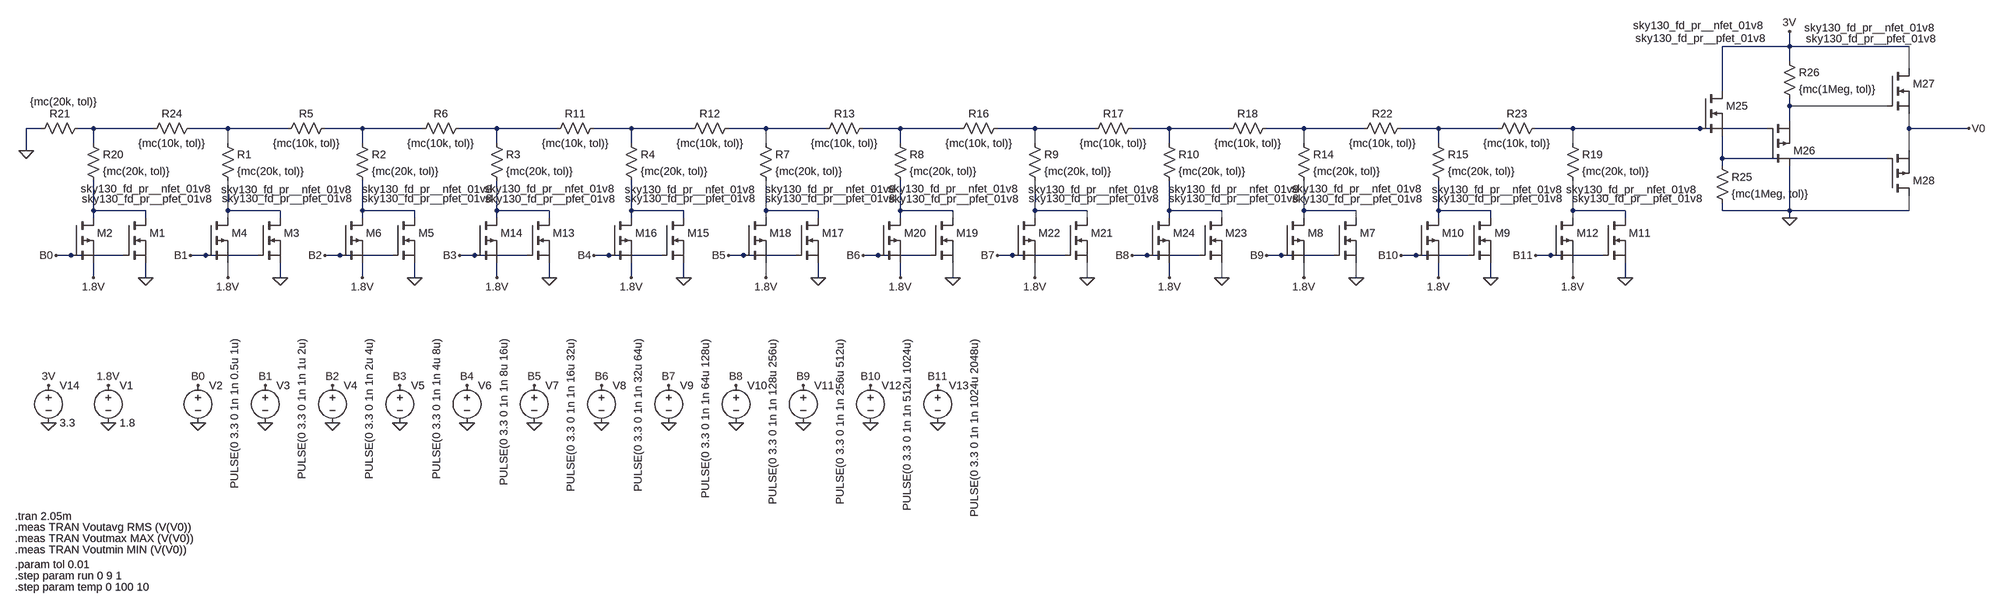
[diagram p0: schematic R2R.asc]
R2R.asc, the LTspice schematic file:
Version 4
SHEET 1 4584 1200
WIRE 3712 -96 3712 -128
WIRE 3712 -96 3568 -96
WIRE 3968 -96 3712 -96
WIRE 3712 -64 3712 -96
WIRE 3968 -48 3968 -96
WIRE 3568 0 3568 -96
WIRE 3712 32 3712 16
WIRE 3920 32 3712 32
WIRE 3712 64 3712 32
WIRE -32 80 -64 80
WIRE 80 80 48 80
WIRE 208 80 80 80
WIRE 368 80 288 80
WIRE 496 80 368 80
WIRE 656 80 576 80
WIRE 784 80 656 80
WIRE 944 80 864 80
WIRE 1072 80 944 80
WIRE 1232 80 1152 80
WIRE 1360 80 1232 80
WIRE 1520 80 1440 80
WIRE 1648 80 1520 80
WIRE 1808 80 1728 80
WIRE 1936 80 1808 80
WIRE 2096 80 2016 80
WIRE 2224 80 2096 80
WIRE 2384 80 2304 80
WIRE 2512 80 2384 80
WIRE 2672 80 2592 80
WIRE 2800 80 2672 80
WIRE 2960 80 2880 80
WIRE 3088 80 2960 80
WIRE 3248 80 3168 80
WIRE 3520 80 3248 80
WIRE 3664 80 3520 80
WIRE 3968 80 3968 48
WIRE 4096 80 3968 80
WIRE 80 112 80 80
WIRE 368 112 368 80
WIRE 656 112 656 80
WIRE 944 112 944 80
WIRE 1232 112 1232 80
WIRE 1520 112 1520 80
WIRE 1808 112 1808 80
WIRE 2096 112 2096 80
WIRE 2384 112 2384 80
WIRE 2672 112 2672 80
WIRE 2960 112 2960 80
WIRE 3248 112 3248 80
WIRE -64 128 -64 80
WIRE 3968 128 3968 80
WIRE 3568 144 3568 96
WIRE 3920 144 3568 144
WIRE 3568 160 3568 144
WIRE 80 256 80 192
WIRE 192 256 80 256
WIRE 368 256 368 192
WIRE 480 256 368 256
WIRE 656 256 656 192
WIRE 768 256 656 256
WIRE 944 256 944 192
WIRE 1056 256 944 256
WIRE 1232 256 1232 192
WIRE 1344 256 1232 256
WIRE 1520 256 1520 192
WIRE 1632 256 1520 256
WIRE 1808 256 1808 192
WIRE 1920 256 1808 256
WIRE 2096 256 2096 192
WIRE 2208 256 2096 256
WIRE 2384 256 2384 192
WIRE 2496 256 2384 256
WIRE 2672 256 2672 192
WIRE 2784 256 2672 256
WIRE 2960 256 2960 192
WIRE 3072 256 2960 256
WIRE 3248 256 3248 192
WIRE 3360 256 3248 256
WIRE 3568 256 3568 240
WIRE 3712 256 3712 160
WIRE 3712 256 3568 256
WIRE 3968 256 3968 224
WIRE 3968 256 3712 256
WIRE 80 272 80 256
WIRE 192 272 192 256
WIRE 368 272 368 256
WIRE 480 272 480 256
WIRE 656 272 656 256
WIRE 768 272 768 256
WIRE 944 272 944 256
WIRE 1056 272 1056 256
WIRE 1232 272 1232 256
WIRE 1344 272 1344 256
WIRE 1520 272 1520 256
WIRE 1632 272 1632 256
WIRE 1808 272 1808 256
WIRE 1920 272 1920 256
WIRE 2096 272 2096 256
WIRE 2208 272 2208 256
WIRE 2384 272 2384 256
WIRE 2496 272 2496 256
WIRE 2672 272 2672 256
WIRE 2784 272 2784 256
WIRE 2960 272 2960 256
WIRE 3072 272 3072 256
WIRE 3248 272 3248 256
WIRE 3360 272 3360 256
WIRE 3712 272 3712 256
WIRE 32 352 0 352
WIRE 144 352 32 352
WIRE 320 352 288 352
WIRE 432 352 320 352
WIRE 608 352 576 352
WIRE 720 352 608 352
WIRE 896 352 864 352
WIRE 1008 352 896 352
WIRE 1184 352 1152 352
WIRE 1296 352 1184 352
WIRE 1472 352 1440 352
WIRE 1584 352 1472 352
WIRE 1760 352 1728 352
WIRE 1872 352 1760 352
WIRE 2048 352 2016 352
WIRE 2160 352 2048 352
WIRE 2336 352 2304 352
WIRE 2448 352 2336 352
WIRE 2624 352 2592 352
WIRE 2736 352 2624 352
WIRE 2912 352 2880 352
WIRE 3024 352 2912 352
WIRE 3200 352 3168 352
WIRE 3312 352 3200 352
WIRE 80 400 80 368
WIRE 192 400 192 368
WIRE 368 400 368 368
WIRE 480 400 480 368
WIRE 656 400 656 368
WIRE 768 400 768 368
WIRE 944 400 944 368
WIRE 1056 400 1056 368
WIRE 1232 400 1232 368
WIRE 1344 400 1344 368
WIRE 1520 400 1520 368
WIRE 1632 400 1632 368
WIRE 1808 400 1808 368
WIRE 1920 400 1920 368
WIRE 2096 400 2096 368
WIRE 2208 400 2208 368
WIRE 2384 400 2384 368
WIRE 2496 400 2496 368
WIRE 2672 400 2672 368
WIRE 2784 400 2784 368
WIRE 2960 400 2960 368
WIRE 3072 400 3072 368
WIRE 3248 400 3248 368
WIRE 3360 400 3360 368
FLAG -64 128 0
FLAG 0 352 B0
FLAG 192 400 0
FLAG 80 400 1.8V
FLAG 288 352 B1
FLAG 480 400 0
FLAG 576 352 B2
FLAG 768 400 0
FLAG 2592 352 B9
FLAG 2784 400 0
FLAG 2880 352 B10
FLAG 3072 400 0
FLAG 3168 352 B11
FLAG 3360 400 0
FLAG 864 352 B3
FLAG 1056 400 0
FLAG 1152 352 B4
FLAG 1344 400 0
FLAG 1440 352 B5
FLAG 1632 400 0
FLAG 1728 352 B6
FLAG 1920 400 0
FLAG 2016 352 B7
FLAG 2208 400 0
FLAG 2304 352 B8
FLAG 2496 400 0
FLAG 112 704 1.8V
FLAG 112 784 0
FLAG 304 704 B0
FLAG 304 784 0
FLAG 448 704 B1
FLAG 448 784 0
FLAG 592 704 B2
FLAG 592 784 0
FLAG 736 704 B3
FLAG 736 784 0
FLAG 880 704 B4
FLAG 880 784 0
FLAG 1024 704 B5
FLAG 1024 784 0
FLAG 1168 704 B6
FLAG 1168 784 0
FLAG 1312 704 B7
FLAG 1312 784 0
FLAG 1456 704 B8
FLAG 1456 784 0
FLAG 1600 704 B9
FLAG 1600 784 0
FLAG 1744 704 B10
FLAG 1744 784 0
FLAG 1888 704 B11
FLAG 1888 784 0
FLAG 3712 272 0
FLAG 3712 -128 3V
FLAG 4096 80 V0
FLAG -16 704 3V
FLAG -16 784 0
FLAG 368 400 1.8V
FLAG 656 400 1.8V
FLAG 944 400 1.8V
FLAG 1232 400 1.8V
FLAG 1520 400 1.8V
FLAG 1808 400 1.8V
FLAG 2096 400 1.8V
FLAG 2384 400 1.8V
FLAG 2672 400 1.8V
FLAG 2960 400 1.8V
FLAG 3248 400 1.8V
SYMBOL nmos 144 272 R0
WINDOW 3 -91 -63 Left 2
SYMATTR Value sky130_fd_pr__nfet_01v8
SYMATTR InstName M1
SYMBOL pmos 32 272 R0
WINDOW 3 23 -41 Left 2
SYMATTR Value sky130_fd_pr__pfet_01v8
SYMATTR InstName M2
SYMBOL nmos 432 272 R0
WINDOW 3 -78 -61 Left 2
SYMATTR Value sky130_fd_pr__nfet_01v8
SYMATTR InstName M3
SYMBOL pmos 320 272 R0
WINDOW 3 35 -42 Left 2
SYMATTR Value sky130_fd_pr__pfet_01v8
SYMATTR InstName M4
SYMBOL nmos 720 272 R0
WINDOW 3 -65 -62 Left 2
SYMATTR Value sky130_fd_pr__nfet_01v8
SYMATTR InstName M5
SYMBOL pmos 608 272 R0
WINDOW 3 47 -42 Left 2
SYMATTR Value sky130_fd_pr__pfet_01v8
SYMATTR InstName M6
SYMBOL nmos 2736 272 R0
WINDOW 3 -91 -63 Left 2
SYMATTR Value sky130_fd_pr__nfet_01v8
SYMATTR InstName M7
SYMBOL pmos 2624 272 R0
WINDOW 3 23 -41 Left 2
SYMATTR Value sky130_fd_pr__pfet_01v8
SYMATTR InstName M8
SYMBOL nmos 3024 272 R0
WINDOW 3 -78 -61 Left 2
SYMATTR Value sky130_fd_pr__nfet_01v8
SYMATTR InstName M9
SYMBOL pmos 2912 272 R0
WINDOW 3 35 -42 Left 2
SYMATTR Value sky130_fd_pr__pfet_01v8
SYMATTR InstName M10
SYMBOL pmos 3200 272 R0
WINDOW 3 47 -42 Left 2
SYMATTR Value sky130_fd_pr__pfet_01v8
SYMATTR InstName M12
SYMBOL nmos 1008 272 R0
WINDOW 3 -91 -63 Left 2
SYMATTR Value sky130_fd_pr__nfet_01v8
SYMATTR InstName M13
SYMBOL pmos 896 272 R0
WINDOW 3 23 -41 Left 2
SYMATTR Value sky130_fd_pr__pfet_01v8
SYMATTR InstName M14
SYMBOL nmos 1296 272 R0
WINDOW 3 -78 -61 Left 2
SYMATTR Value sky130_fd_pr__nfet_01v8
SYMATTR InstName M15
SYMBOL pmos 1184 272 R0
WINDOW 3 35 -42 Left 2
SYMATTR Value sky130_fd_pr__pfet_01v8
SYMATTR InstName M16
SYMBOL nmos 1584 272 R0
WINDOW 3 -65 -62 Left 2
SYMATTR Value sky130_fd_pr__nfet_01v8
SYMATTR InstName M17
SYMBOL pmos 1472 272 R0
WINDOW 3 47 -42 Left 2
SYMATTR Value sky130_fd_pr__pfet_01v8
SYMATTR InstName M18
SYMBOL nmos 1872 272 R0
WINDOW 3 -91 -63 Left 2
SYMATTR Value sky130_fd_pr__nfet_01v8
SYMATTR InstName M19
SYMBOL pmos 1760 272 R0
WINDOW 3 23 -41 Left 2
SYMATTR Value sky130_fd_pr__pfet_01v8
SYMATTR InstName M20
SYMBOL nmos 2160 272 R0
WINDOW 3 -78 -61 Left 2
SYMATTR Value sky130_fd_pr__nfet_01v8
SYMATTR InstName M21
SYMBOL pmos 2048 272 R0
WINDOW 3 35 -42 Left 2
SYMATTR Value sky130_fd_pr__pfet_01v8
SYMATTR InstName M22
SYMBOL nmos 2448 272 R0
WINDOW 3 -65 -62 Left 2
SYMATTR Value sky130_fd_pr__nfet_01v8
SYMATTR InstName M23
SYMBOL pmos 2336 272 R0
WINDOW 3 47 -42 Left 2
SYMATTR Value sky130_fd_pr__pfet_01v8
SYMATTR InstName M24
SYMBOL voltage 112 688 R0
WINDOW 123 0 0 Left 0
WINDOW 39 0 0 Left 0
SYMATTR InstName V1
SYMATTR Value 1.8
SYMBOL voltage 304 688 R0
WINDOW 3 79 -86 VRight 2
WINDOW 123 0 0 Left 0
WINDOW 39 0 0 Left 0
SYMATTR Value PULSE(0 3.3 0 1n 1n 0.5u 1u)
SYMATTR InstName V2
SYMBOL voltage 448 688 R0
WINDOW 3 79 -86 VRight 2
WINDOW 123 0 0 Left 0
WINDOW 39 0 0 Left 0
SYMATTR Value PULSE(0 3.3 0 1n 1n 1u 2u)
SYMATTR InstName V3
SYMBOL voltage 592 688 R0
WINDOW 3 79 -86 VRight 2
WINDOW 123 0 0 Left 0
WINDOW 39 0 0 Left 0
SYMATTR Value PULSE(0 3.3 0 1n 1n 2u 4u)
SYMATTR InstName V4
SYMBOL voltage 736 688 R0
WINDOW 3 79 -86 VRight 2
WINDOW 123 0 0 Left 0
WINDOW 39 0 0 Left 0
SYMATTR Value PULSE(0 3.3 0 1n 1n 4u 8u)
SYMATTR InstName V5
SYMBOL voltage 880 688 R0
WINDOW 3 79 -86 VRight 2
WINDOW 123 0 0 Left 0
WINDOW 39 0 0 Left 0
SYMATTR Value PULSE(0 3.3 0 1n 1n 8u 16u)
SYMATTR InstName V6
SYMBOL voltage 1024 688 R0
WINDOW 3 79 -86 VRight 2
WINDOW 123 0 0 Left 0
WINDOW 39 0 0 Left 0
SYMATTR Value PULSE(0 3.3 0 1n 1n 16u 32u)
SYMATTR InstName V7
SYMBOL voltage 1168 688 R0
WINDOW 3 79 -86 VRight 2
WINDOW 123 0 0 Left 0
WINDOW 39 0 0 Left 0
SYMATTR Value PULSE(0 3.3 0 1n 1n 32u 64u)
SYMATTR InstName V8
SYMBOL voltage 1312 688 R0
WINDOW 3 79 -86 VRight 2
WINDOW 123 0 0 Left 0
WINDOW 39 0 0 Left 0
SYMATTR Value PULSE(0 3.3 0 1n 1n 64u 128u)
SYMATTR InstName V9
SYMBOL voltage 1456 688 R0
WINDOW 3 79 -86 VRight 2
WINDOW 123 0 0 Left 0
WINDOW 39 0 0 Left 0
SYMATTR Value PULSE(0 3.3 0 1n 1n 128u 256u)
SYMATTR InstName V10
SYMBOL voltage 1600 688 R0
WINDOW 3 79 -86 VRight 2
WINDOW 123 0 0 Left 0
WINDOW 39 0 0 Left 0
SYMATTR Value PULSE(0 3.3 0 1n 1n 256u 512u)
SYMATTR InstName V11
SYMBOL voltage 1744 688 R0
WINDOW 3 79 -86 VRight 2
WINDOW 123 0 0 Left 0
WINDOW 39 0 0 Left 0
SYMATTR Value PULSE(0 3.3 0 1n 1n 512u 1024u)
SYMATTR InstName V12
SYMBOL voltage 1888 688 R0
WINDOW 3 79 -86 VRight 2
WINDOW 123 0 0 Left 0
WINDOW 39 0 0 Left 0
SYMATTR Value PULSE(0 3.3 0 1n 1n 1024u 2048u)
SYMATTR InstName V13
SYMBOL nmos 3520 0 R0
WINDOW 3 224 -136 Left 2
SYMATTR Value sky130_fd_pr__nfet_01v8
SYMATTR InstName M25
SYMBOL pmos 3664 160 M180
WINDOW 3 83 272 Left 2
SYMATTR Value sky130_fd_pr__pfet_01v8
SYMATTR InstName M26
SYMBOL nmos 3920 -48 R0
WINDOW 3 -543 -93 Left 2
SYMATTR Value sky130_fd_pr__nfet_01v8
SYMATTR InstName M27
SYMBOL res 3552 144 R0
SYMATTR InstName R25
SYMATTR Value {mc(1Meg, tol)}
SYMBOL res 3696 -80 R0
SYMATTR InstName R26
SYMATTR Value {mc(1Meg, tol)}
SYMBOL pmos 3920 224 M180
WINDOW 3 -538 337 Left 2
SYMATTR Value sky130_fd_pr__pfet_01v8
SYMATTR InstName M28
SYMBOL voltage -16 688 R0
WINDOW 123 0 0 Left 0
WINDOW 39 0 0 Left 0
SYMATTR InstName V14
SYMATTR Value 3.3
SYMBOL res 304 64 R90
WINDOW 0 0 56 VBottom 2
WINDOW 3 32 56 VTop 2
SYMATTR InstName R24
SYMATTR Value {mc(10k, tol)}
SYMBOL nmos 3312 272 R0
WINDOW 3 -78 -61 Left 2
SYMATTR Value sky130_fd_pr__nfet_01v8
SYMATTR InstName M11
SYMBOL res 64 64 R90
WINDOW 0 0 56 VBottom 2
WINDOW 3 -57 48 VTop 2
SYMATTR InstName R21
SYMATTR Value {mc(20k, tol)}
SYMBOL res 64 96 R0
SYMATTR InstName R20
SYMATTR Value {mc(20k, tol)}
SYMBOL res 352 96 R0
SYMATTR InstName R1
SYMATTR Value {mc(20k, tol)}
SYMBOL res 640 96 R0
SYMATTR InstName R2
SYMATTR Value {mc(20k, tol)}
SYMBOL res 928 96 R0
SYMATTR InstName R3
SYMATTR Value {mc(20k, tol)}
SYMBOL res 1216 96 R0
SYMATTR InstName R4
SYMATTR Value {mc(20k, tol)}
SYMBOL res 1504 96 R0
SYMATTR InstName R7
SYMATTR Value {mc(20k, tol)}
SYMBOL res 1792 96 R0
SYMATTR InstName R8
SYMATTR Value {mc(20k, tol)}
SYMBOL res 2080 96 R0
SYMATTR InstName R9
SYMATTR Value {mc(20k, tol)}
SYMBOL res 2368 96 R0
SYMATTR InstName R10
SYMATTR Value {mc(20k, tol)}
SYMBOL res 2656 96 R0
SYMATTR InstName R14
SYMATTR Value {mc(20k, tol)}
SYMBOL res 2944 96 R0
SYMATTR InstName R15
SYMATTR Value {mc(20k, tol)}
SYMBOL res 3232 96 R0
SYMATTR InstName R19
SYMATTR Value {mc(20k, tol)}
SYMBOL res 592 64 R90
WINDOW 0 0 56 VBottom 2
WINDOW 3 32 56 VTop 2
SYMATTR InstName R5
SYMATTR Value {mc(10k, tol)}
SYMBOL res 880 64 R90
WINDOW 0 0 56 VBottom 2
WINDOW 3 32 56 VTop 2
SYMATTR InstName R6
SYMATTR Value {mc(10k, tol)}
SYMBOL res 1168 64 R90
WINDOW 0 0 56 VBottom 2
WINDOW 3 32 56 VTop 2
SYMATTR InstName R11
SYMATTR Value {mc(10k, tol)}
SYMBOL res 1456 64 R90
WINDOW 0 0 56 VBottom 2
WINDOW 3 32 56 VTop 2
SYMATTR InstName R12
SYMATTR Value {mc(10k, tol)}
SYMBOL res 1744 64 R90
WINDOW 0 0 56 VBottom 2
WINDOW 3 32 56 VTop 2
SYMATTR InstName R13
SYMATTR Value {mc(10k, tol)}
SYMBOL res 2032 64 R90
WINDOW 0 0 56 VBottom 2
WINDOW 3 32 56 VTop 2
SYMATTR InstName R16
SYMATTR Value {mc(10k, tol)}
SYMBOL res 2320 64 R90
WINDOW 0 0 56 VBottom 2
WINDOW 3 32 56 VTop 2
SYMATTR InstName R17
SYMATTR Value {mc(10k, tol)}
SYMBOL res 2608 64 R90
WINDOW 0 0 56 VBottom 2
WINDOW 3 32 56 VTop 2
SYMATTR InstName R18
SYMATTR Value {mc(10k, tol)}
SYMBOL res 2896 64 R90
WINDOW 0 0 56 VBottom 2
WINDOW 3 32 56 VTop 2
SYMATTR InstName R22
SYMATTR Value {mc(10k, tol)}
SYMBOL res 3184 64 R90
WINDOW 0 0 56 VBottom 2
WINDOW 3 32 56 VTop 2
SYMATTR InstName R23
SYMATTR Value {mc(10k, tol)}
TEXT -88 984 Left 2 !.tran 2.05m
TEXT -88 1008 Left 2 !.meas TRAN Voutavg RMS (V(V0))
TEXT -88 1032 Left 2 !.meas TRAN Voutmax MAX (V(V0))
TEXT -88 1056 Left 2 !.meas TRAN Voutmin MIN (V(V0))
TEXT -88 1088 Left 2 !.param tol 0.01
TEXT -88 1112 Left 2 !.step param run 0 9 1
TEXT -88 1136 Left 2 !.step param temp 0 100 10

The netlist it stands for:
* R2R.asc
M1 N015 B0 0 0 sky130_fd_pr__nfet_01v8
M2 N015 B0 1.8V 1.8V sky130_fd_pr__pfet_01v8
M3 N016 B1 0 0 sky130_fd_pr__nfet_01v8
M4 N016 B1 1.8V 1.8V sky130_fd_pr__pfet_01v8
M5 N017 B2 0 0 sky130_fd_pr__nfet_01v8
M6 N017 B2 1.8V 1.8V sky130_fd_pr__pfet_01v8
M7 N024 B9 0 0 sky130_fd_pr__nfet_01v8
M8 N024 B9 1.8V 1.8V sky130_fd_pr__pfet_01v8
M9 N025 B10 0 0 sky130_fd_pr__nfet_01v8
M10 N025 B10 1.8V 1.8V sky130_fd_pr__pfet_01v8
M12 N026 B11 1.8V 1.8V sky130_fd_pr__pfet_01v8
M13 N018 B3 0 0 sky130_fd_pr__nfet_01v8
M14 N018 B3 1.8V 1.8V sky130_fd_pr__pfet_01v8
M15 N019 B4 0 0 sky130_fd_pr__nfet_01v8
M16 N019 B4 1.8V 1.8V sky130_fd_pr__pfet_01v8
M17 N020 B5 0 0 sky130_fd_pr__nfet_01v8
M18 N020 B5 1.8V 1.8V sky130_fd_pr__pfet_01v8
M19 N021 B6 0 0 sky130_fd_pr__nfet_01v8
M20 N021 B6 1.8V 1.8V sky130_fd_pr__pfet_01v8
M21 N022 B7 0 0 sky130_fd_pr__nfet_01v8
M22 N022 B7 1.8V 1.8V sky130_fd_pr__pfet_01v8
M23 N023 B8 0 0 sky130_fd_pr__nfet_01v8
M24 N023 B8 1.8V 1.8V sky130_fd_pr__pfet_01v8
V1 1.8V 0 1.8
V2 B0 0 PULSE(0 3.3 0 1n 1n 0.5u 1u)
V3 B1 0 PULSE(0 3.3 0 1n 1n 1u 2u)
V4 B2 0 PULSE(0 3.3 0 1n 1n 2u 4u)
V5 B3 0 PULSE(0 3.3 0 1n 1n 4u 8u)
V6 B4 0 PULSE(0 3.3 0 1n 1n 8u 16u)
V7 B5 0 PULSE(0 3.3 0 1n 1n 16u 32u)
V8 B6 0 PULSE(0 3.3 0 1n 1n 32u 64u)
V9 B7 0 PULSE(0 3.3 0 1n 1n 64u 128u)
V10 B8 0 PULSE(0 3.3 0 1n 1n 128u 256u)
V11 B9 0 PULSE(0 3.3 0 1n 1n 256u 512u)
V12 B10 0 PULSE(0 3.3 0 1n 1n 512u 1024u)
V13 B11 0 PULSE(0 3.3 0 1n 1n 1024u 2048u)
M25 3V N013 N014 N014 sky130_fd_pr__nfet_01v8
M26 0 N013 N001 N001 sky130_fd_pr__pfet_01v8
M27 3V N001 V0 V0 sky130_fd_pr__nfet_01v8
R25 N014 0 {mc(1Meg, tol)}
R26 3V N001 {mc(1Meg, tol)}
M28 0 N014 V0 V0 sky130_fd_pr__pfet_01v8
V14 3V 0 3.3
R24 N003 N002 {mc(10k, tol)}
M11 N026 B11 0 0 sky130_fd_pr__nfet_01v8
R21 N002 0 {mc(20k, tol)}
R20 N002 N015 {mc(20k, tol)}
R1 N003 N016 {mc(20k, tol)}
R2 N004 N017 {mc(20k, tol)}
R3 N005 N018 {mc(20k, tol)}
R4 N006 N019 {mc(20k, tol)}
R7 N007 N020 {mc(20k, tol)}
R8 N008 N021 {mc(20k, tol)}
R9 N009 N022 {mc(20k, tol)}
R10 N010 N023 {mc(20k, tol)}
R14 N011 N024 {mc(20k, tol)}
R15 N012 N025 {mc(20k, tol)}
R19 N013 N026 {mc(20k, tol)}
R5 N004 N003 {mc(10k, tol)}
R6 N005 N004 {mc(10k, tol)}
R11 N006 N005 {mc(10k, tol)}
R12 N007 N006 {mc(10k, tol)}
R13 N008 N007 {mc(10k, tol)}
R16 N009 N008 {mc(10k, tol)}
R17 N010 N009 {mc(10k, tol)}
R18 N011 N010 {mc(10k, tol)}
R22 N012 N011 {mc(10k, tol)}
R23 N013 N012 {mc(10k, tol)}
.model NMOS NMOS
.model PMOS PMOS
.lib standard.mos
.tran 2.05m
.meas TRAN Voutavg RMS (V(V0))
.meas TRAN Voutmax MAX (V(V0))
.meas TRAN Voutmin MIN (V(V0))
.param tol 0.01
.step param run 0 9 1
.step param temp 0 100 10
.backanno
.end